# Altium schematic sheet puente H rama 2.SchDoc
size A4
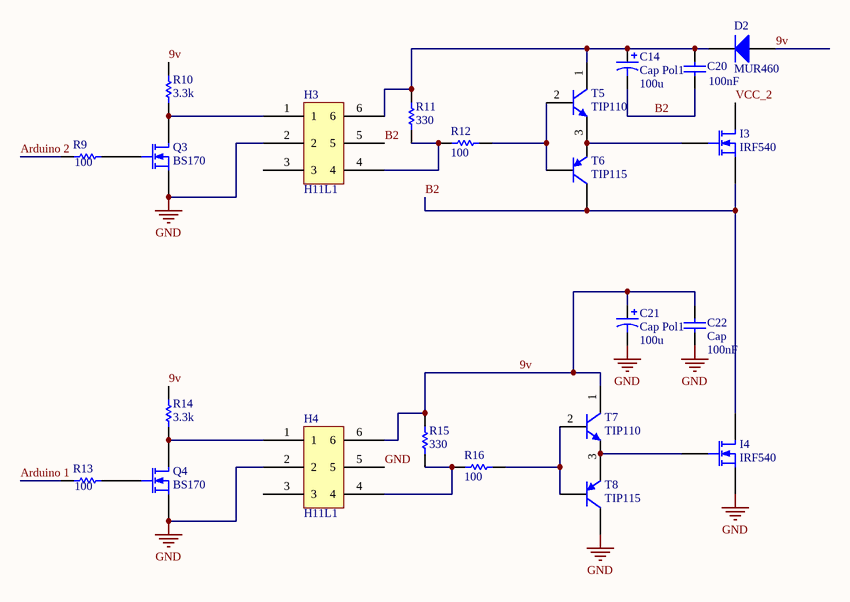
[diagram p0: puente H rama 2.SchDoc]

## Parts
C14  Cap Pol1  value 100u  [A]
C20  value 100nF  [C1206]  (hidden comment: Cap)
C21  Cap Pol1  value 100u  [A]
C22  Cap  value 100nF  [C1206]
D2  MUR460  [DO-201AD]
H3  H11L1  [DIP-6]
H4  H11L1  [DIP-6]
I3  IRF540  [TO-220AB]
I4  IRF540  [TO-220-AB]
Q3  BS170  [E3]
Q4  BS170  [E3]
R9  value 100  [3216[1206]]  (hidden comment: Res1)
R10  value 3.3k  [3216[1206]]  (hidden comment: Res1)
R11  value 330  [3216[1206]]  (hidden comment: Res1)
R12  value 100  [3216[1206]]  (hidden comment: Res1)
R13  value 100  [3216[1206]]  (hidden comment: Res1)
R14  value 3.3k  [3216[1206]]  (hidden comment: Res1)
R15  value 330  [3216[1206]]  (hidden comment: Res1)
R16  value 100  [3216[1206]]  (hidden comment: Res1)
T5  TIP110  [TO-220-AB]
T6  TIP115  [TO-220-AB]
T7  TIP110  [TO-220-AB]
T8  TIP115  [TO-220-AB]

## Nets
GND: C21.2 C22.1 H3.2 H4.2 H4.5 I4.3(S) Q3.3(S) Q4.3(S) T8.1(C)
9v: C21.1 C22.2 D2.1(A) H4.6 R10.2 R14.2 R15.2 T7.1(C)
Arduino 1: R13.1
Arduino 2: R9.1
B2: C14.2 C20.1 H3.5 I3.3(S) I4.1(D) T6.1(C)
VCC_2: I3.1(D)
NetC14_1: C14.1 C20.2 D2.2(K) H3.6 R11.2 T5.1(C)
NetH3_1: H3.1 Q3.1(D) R10.1
NetH3_4: H3.4 R11.1 R12.2
NetH4_1: H4.1 Q4.1(D) R14.1
NetH4_4: H4.4 R15.1 R16.2
NetI3_2: I3.2(G) T5.3(E) T6.3(E)
NetI4_2: I4.2(G) T7.3(E) T8.3(E)
NetQ3_2: Q3.2(G) R9.2
NetQ4_2: Q4.2(G) R13.2
NetR12_1: R12.1 T5.2(B) T6.2(B)
NetR16_1: R16.1 T7.2(B) T8.2(B)

Not connected (* = marked no-connect by the designer): H3 3; H4 3

## Library data of the parts
C14 C21 = Cap Pol1: Polarized Capacitor (Radial); Published: 8-Jun-2000; LatestRevisionDate: 17-Jul-2002; LatestRevisionNote: Re-released for DXP Platform.; PackageReference: RB7.6-15; Publisher: Altium Limited
C20 C22 = Cap: Capacitor; Published: 8-Jun-2000; LatestRevisionDate: 17-Jul-2002; LatestRevisionNote: Re-released for DXP Platform.; PackageReference: RAD-0.3; Publisher: Altium Limited
D2 = Diode: Default Diode; Published: 8-Jun-2000; LatestRevisionDate: 17-Jul-2002; LatestRevisionNote: Re-released for DXP Platform.; PackageDocument: Sep-1996; PackageReference: SMC; Publisher: Altium Limited; Code_JEDEC: DO-214-AB
I3 I4 = MOSFET-N: N-Channel MOSFET; pin to pad: 1>2 2>1; PackageDocument: 1995/1996; Published: 8-Jun-2000; LatestRevisionDate: 17-Jul-2002; LatestRevisionNote: Re-released for DXP Platform.; PackageReference: E3; Publisher: Altium Limited
Q3 Q4 = MOSFET-N: N-Channel MOSFET; PackageDocument: 1995/1996; Published: 8-Jun-2000; LatestRevisionDate: 17-Jul-2002; LatestRevisionNote: Re-released for DXP Platform.; PackageReference: E3; Publisher: Altium Limited
R9-R16 = Res1: Resistor; Published: 8-Jun-2000; LatestRevisionDate: 17-Jul-2002; LatestRevisionNote: Re-released for DXP Platform.; PackageReference: AXIAL-0.3; Publisher: Altium Limited
T5 T7 = NPN: NPN Bipolar Transistor; pin to pad: 1>2 2>1; Published: 8-Jun-2000; LatestRevisionDate: 17-Jul-2002; LatestRevisionNote: Re-released for DXP Platform.; PackageReference: TO-226; Publisher: Altium Limited; Code_JEDEC: TO-226-AA
T6 T8 = PNP: PNP Bipolar Transistor; pin to pad: 1>2 2>1; Published: 8-Jun-2000; LatestRevisionDate: 17-Jul-2002; LatestRevisionNote: Re-released for DXP Platform.; PackageReference: SOT-23B; Publisher: Altium Limited; Code_JEDEC: SOT-23